# Altium schematic sheet TOP.SchDoc
size A4; Author: Audran; CompanyName: Goldorak; Address1: Electrolab; Address2: 52 rue Paul Lescop; Address3: 92000 Nanterre; DocumentNumber: 1; SheetNumber: 1; SheetTotal: 8; ProjectName: Cartes_2017
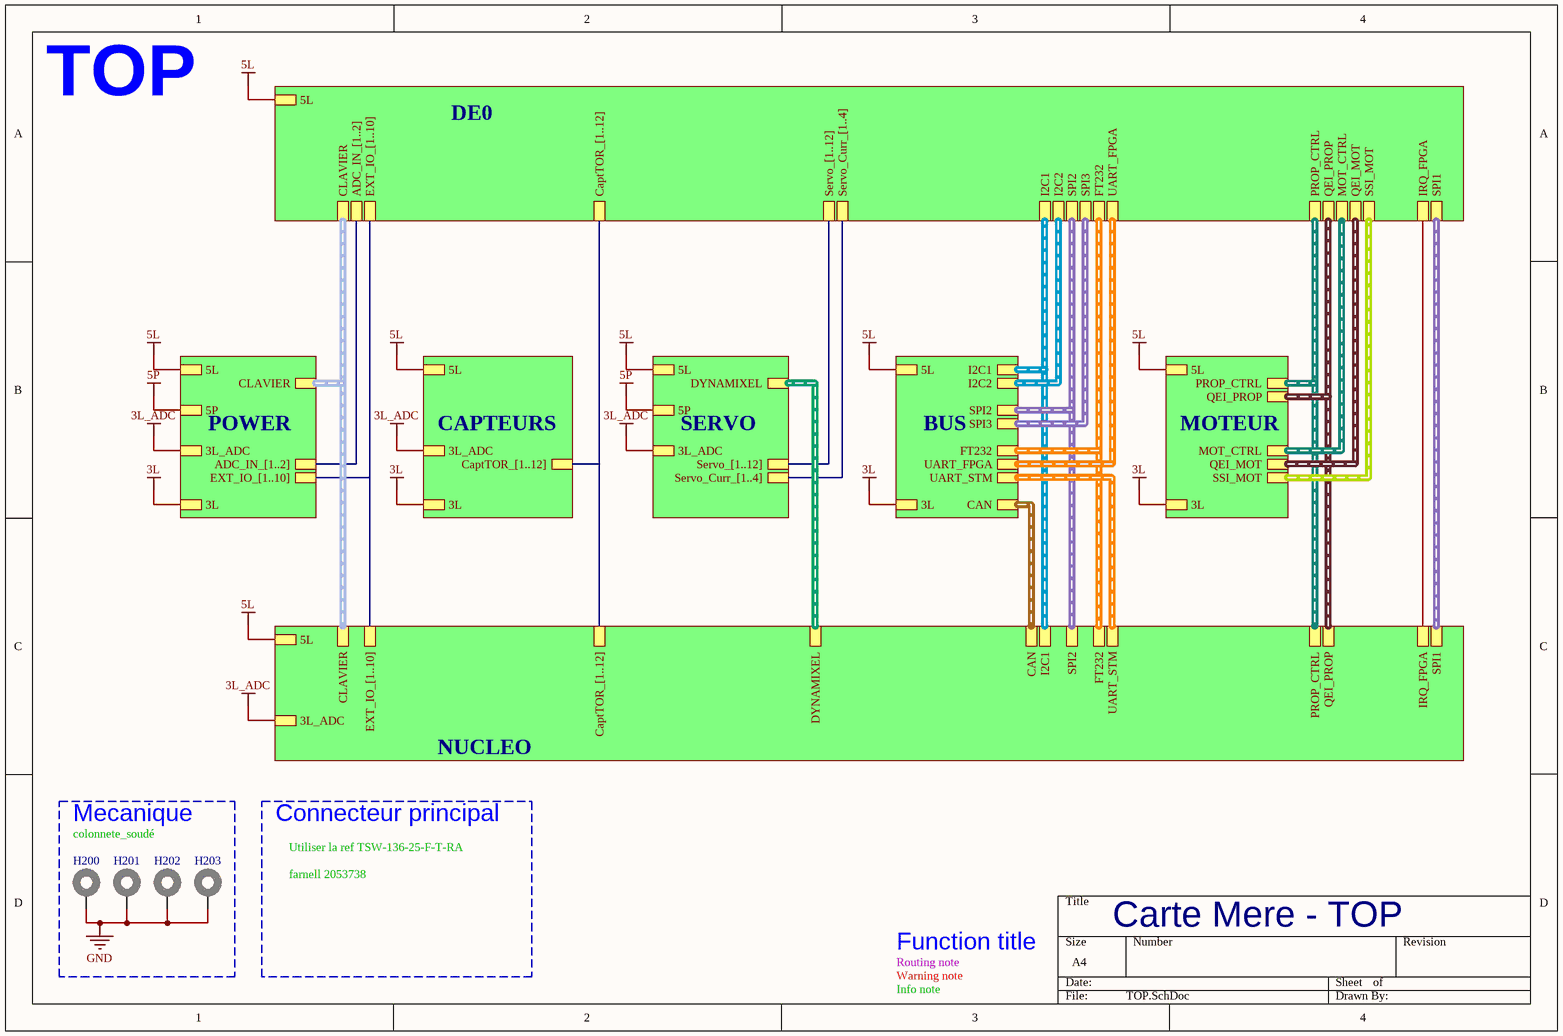
[diagram p0: TOP.SchDoc]

## Parts
H200  9774100960  [9774100960]  (value not drawn)
H201  9774100960  [9774100960]  (value not drawn)
H202  9774100960  [9774100960]  (value not drawn)
H203  9774100960  [9774100960]  (value not drawn)

## Sub-sheets
BUS = Interface_BUS.SchDoc: SPI2 (harness SPI2), SPI3 (harness SPI3), FT232 (harness FT232), I2C1 (harness I2C1), I2C2 (harness I2C2), 5L, UART_FPGA (harness UART_FPGA), UART_STM (harness UART_STM), CAN (harness CAN), 3L
CAPTEURS = Capteur.SchDoc: 3L_ADC, 5L, CaptTOR_[1..12], 3L
DE0 = DE0_Nano.SchDoc: FT232 (harness FT232), Servo_Curr_[1..4] (harness CLAVIER), UART_FPGA (harness UART_FPGA), CaptTOR_[1..12], SSI_MOT (harness SSI_MOT), I2C2 (harness I2C2), SPI1 (harness SPI1), IRQ_FPGA, CLAVIER (harness CLAVIER), I2C1 (harness I2C1), 5L, Servo_[1..12], SPI3 (harness SPI3), SPI2 (harness SPI2), QEI_MOT (harness QEI_MOT), MOT_CTRL (harness MOT_CTRL), QEI_PROP (harness QEI_PROP), PROP_CTRL (harness PROP_CTRL), ADC_IN_[1..2], EXT_IO_[1..10]
MOTEUR = Motorisation.SchDoc: QEI_PROP (harness QEI_PROP), QEI_MOT (harness QEI_MOT), MOT_CTRL (harness MOT_CTRL), 3L, PROP_CTRL (harness PROP_CTRL), SSI_MOT (harness SSI_MOT), 5L
NUCLEO = Nucleo.SchDoc: SPI1 (harness SPI1), UART_STM (harness UART_STM), I2C1 (harness I2C1), DYNAMIXEL (harness DYNAMIXEL), CaptTOR_[1..12], CAN (harness CAN), FT232 (harness FT232), SPI2 (harness SPI2), IRQ_FPGA, 3L_ADC, 5L, QEI_PROP (harness QEI_PROP), PROP_CTRL (harness PROP_CTRL), CLAVIER (harness CLAVIER), EXT_IO_[1..10]
POWER = Power.SchDoc: CLAVIER (harness CLAVIER), 3L, 3L_ADC, 5P, 5L, EXT_IO_[1..10], ADC_IN_[1..2]
SERVO = Servomoteur.SchDoc: 5L, DYNAMIXEL (harness DYNAMIXEL), 5P, 3L_ADC, Servo_[1..12], Servo_Curr_[1..4]

## Nets
3L: sheet CAPTEURS/3L, sheet BUS/3L, sheet MOTEUR/3L, sheet POWER/3L
3L_ADC: sheet NUCLEO/3L_ADC, sheet CAPTEURS/3L_ADC, sheet POWER/3L_ADC, sheet SERVO/3L_ADC
5L: sheet DE0/5L, sheet NUCLEO/5L, sheet CAPTEURS/5L, sheet BUS/5L, sheet MOTEUR/5L, sheet POWER/5L, sheet SERVO/5L
5P: sheet POWER/5P, sheet SERVO/5P
GND: H200.1 H201.1 H202.1 H203.1
(unnamed): sheet DE0/IRQ_FPGA, sheet NUCLEO/IRQ_FPGA

## Buses and harness runs
bus sheet CAPTEURS/CaptTOR_[1..12] = sheet DE0/CaptTOR_[1..12] = sheet NUCLEO/CaptTOR_[1..12]
bus sheet DE0/ADC_IN_[1..2] = sheet POWER/ADC_IN_[1..2]
bus sheet DE0/EXT_IO_[1..10] = sheet NUCLEO/EXT_IO_[1..10] = sheet POWER/EXT_IO_[1..10]
bus sheet DE0/Servo_[1..12] = sheet SERVO/Servo_[1..12]
harness sheet BUS/CAN = sheet NUCLEO/CAN
harness sheet BUS/FT232 = sheet DE0/FT232 = sheet NUCLEO/FT232
harness sheet BUS/I2C1 = sheet DE0/I2C1 = sheet NUCLEO/I2C1
harness sheet BUS/I2C2 = sheet DE0/I2C2
harness sheet BUS/SPI2 = sheet DE0/SPI2 = sheet NUCLEO/SPI2
harness sheet BUS/SPI3 = sheet DE0/SPI3
harness sheet BUS/UART_FPGA = sheet DE0/UART_FPGA
harness sheet BUS/UART_STM = sheet NUCLEO/UART_STM
harness sheet DE0/CLAVIER = sheet NUCLEO/CLAVIER = sheet POWER/CLAVIER
harness sheet DE0/MOT_CTRL = sheet MOTEUR/MOT_CTRL
harness sheet DE0/PROP_CTRL = sheet MOTEUR/PROP_CTRL = sheet NUCLEO/PROP_CTRL
harness sheet DE0/QEI_MOT = sheet MOTEUR/QEI_MOT
harness sheet DE0/QEI_PROP = sheet MOTEUR/QEI_PROP = sheet NUCLEO/QEI_PROP
harness sheet DE0/SPI1 = sheet NUCLEO/SPI1
harness sheet DE0/SSI_MOT = sheet MOTEUR/SSI_MOT
harness sheet NUCLEO/DYNAMIXEL = sheet SERVO/DYNAMIXEL

## Notes on the sheet
- TOP
- Mecanique
- colonnete_soudé
- Connecteur principal
- Utiliser la ref TSW-136-25-F-T-RA
- farnell 2053738
- Routing note
- Warning note
- Function title
- Carte Mere - TOP
- Info note

## Library data of the parts
H200-H203 = 9774100960: WA-SMST SMT Steel Spacer with through hole, OD6mm, ID3.3xL10mm; Manufacturer: Wurth Elektronik; Value: 3.3x10; ComponentLink1Description: Manufacturer; ComponentLink1URL: https://www.we-online.com/catalog/en/SMST_SMD_STEEL_SPACER_3_3_INTERNAL_NON_STOP/#9774100960; ComponentLink2Description: Datasheet; ComponentLink2URL: https://www.we-online.com/catalog/datasheet/9774100960.pdf; Manufacturer Part Number: 9774100960; Supplier 1: Farnell; Supplier Part Number 1: 2497637